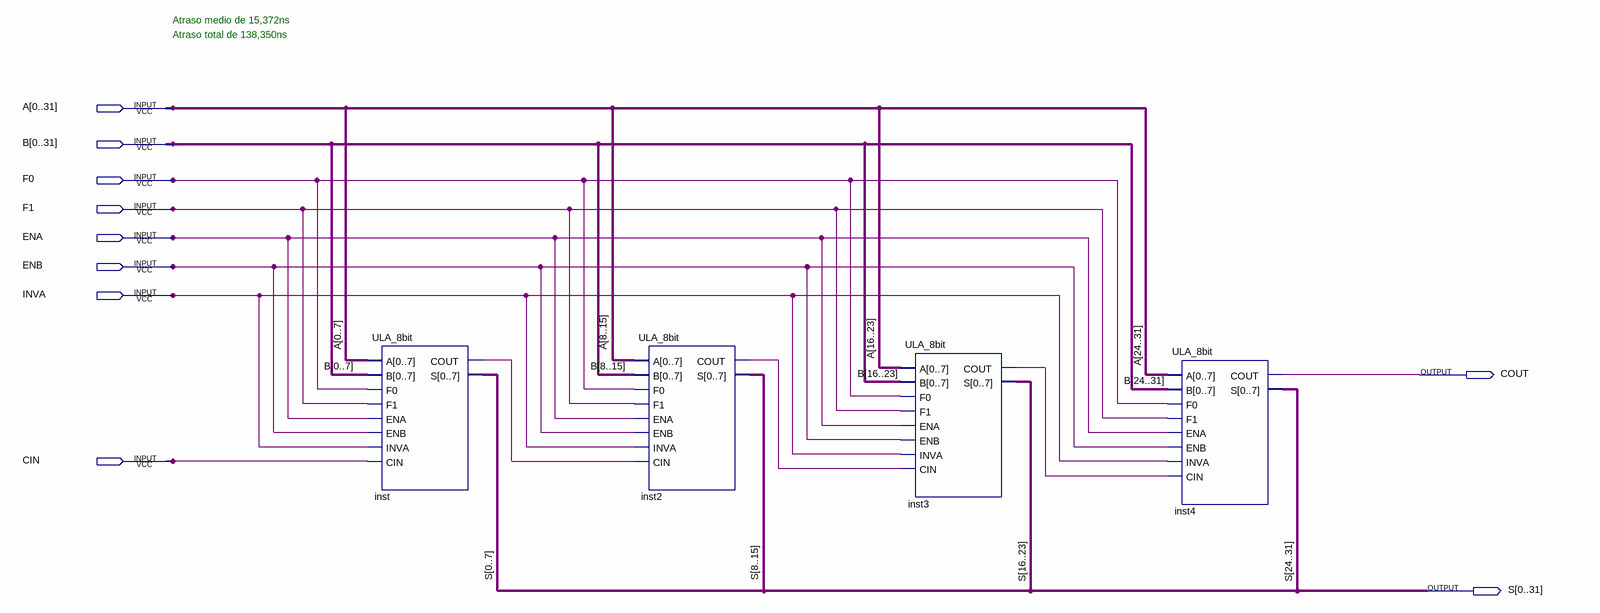
[diagram p0: schematic sheet]
// Quartus schematic ULA_32bit.bdf as structural Verilog: 4 symbols, 10 pins
module ULA_32bit (
  input  [0:31] A,
  input  [0:31] B,
  input  F0,
  input  F1,
  input  ENA,
  input  ENB,
  input  INVA,
  input  CIN,
  output COUT,
  output [0:31] S
);

  wire inst2_cout, inst3_cout, inst_cout;

  ULA_8bit inst (
    .A(A[0:7]), .B(B[0:7]), .F0(F0), .F1(F1), .ENA(ENA), .ENB(ENB), .INVA(INVA), .CIN(CIN), .COUT(inst_cout),
    .S(S[0:7]));
  ULA_8bit inst2 (
    .A(A[8:15]), .B(B[8:15]), .F0(F0), .F1(F1), .ENA(ENA), .ENB(ENB), .INVA(INVA), .CIN(inst_cout),
    .COUT(inst2_cout), .S(S[8:15]));
  ULA_8bit inst3 (
    .A(A[16:23]), .B(B[16:23]), .F0(F0), .F1(F1), .ENA(ENA), .ENB(ENB), .INVA(INVA), .CIN(inst2_cout),
    .COUT(inst3_cout), .S(S[16:23]));
  ULA_8bit inst4 (
    .A(A[24:31]), .B(B[24:31]), .F0(F0), .F1(F1), .ENA(ENA), .ENB(ENB), .INVA(INVA), .CIN(inst3_cout),
    .COUT(COUT), .S(S[24:31]));

  // Notes on the sheet:
  //   Atraso medio de 15,372ns
  //   Atraso total de 138,350ns
endmodule
